# EAGLE design ziegler_sct (EAGLE 9.0.1)
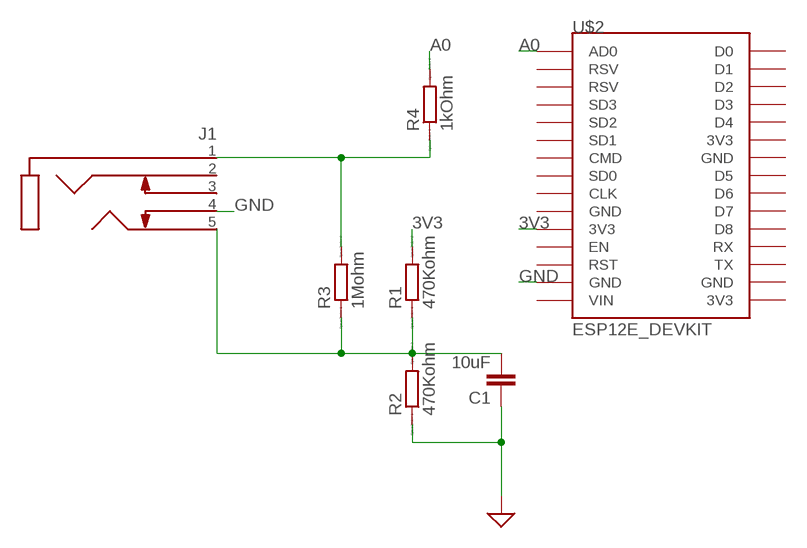
[diagram p0: schematic, sheet 1]

## Parts
C1  10uF  C5/3  [C5B3]
J1  STEREO_JACK3F07  [3.5AUDIO_3F07]
R1  470Kohm  R0204/7  [0204/7]
R2  470Kohm  R0204/7  [0204/7]
R3  1Mohm  R0204/7  [0204/7]
R4  1kOhm  R0204/7  [0204/7]
U$2  ESP12E_DEVKIT  [ESP12E_DEVKIT]

## Nets
3V3: R1.2 U$2.3V3@0(3V3)
A0: R4.2 U$2.AD0
GND: C1.1 J1.4(RSWITCH) R2.1 U$2.GND@1(GND) ; supply symbol labelled SUP
N$1: C1.2 J1.5(RING) R1.1 R2.2 R3.1
N$2: J1.1(SLEEVE) R3.2 R4.1
Unconnected: J1.2(TIP) J1.3(TSWITCH) U$2.3V3@1(3V3) U$2.3V3@2(3V3) U$2.CLK U$2.CMD U$2.D0 U$2.D1 U$2.D2 U$2.D3 U$2.D4 U$2.D5 U$2.D6 U$2.D7 U$2.D8 U$2.EN U$2.GND@0(GND) U$2.GND@2(GND) U$2.GND@3(GND) U$2.RST U$2.RSV@0(RSV) U$2.RSV@1(RSV) U$2.RX U$2.SD0 U$2.SD1 U$2.SD2 U$2.SD3 U$2.TX U$2.VIN

## Library data of the parts
C1 = capacitor-wima:C: CAPACITOR naming: grid - package width
J1 = bt_electromech:STEREO_JACK: 3.5mm Stereo Audio Jack with insert detect switches.
R1-R4 = eagle-ltspice:R: RESISTOR, European symbol; SPICEMODEL: NONE; SPICEPREFIX: R
U$2 = ESP12E_DEVKIT:ESP12E_DEVKIT: ESP12E DEVKIT BOARD

## Net classes
0 default: width 0.305 mm, drill 0.508 mm, clearance 0.254 mm

## Board
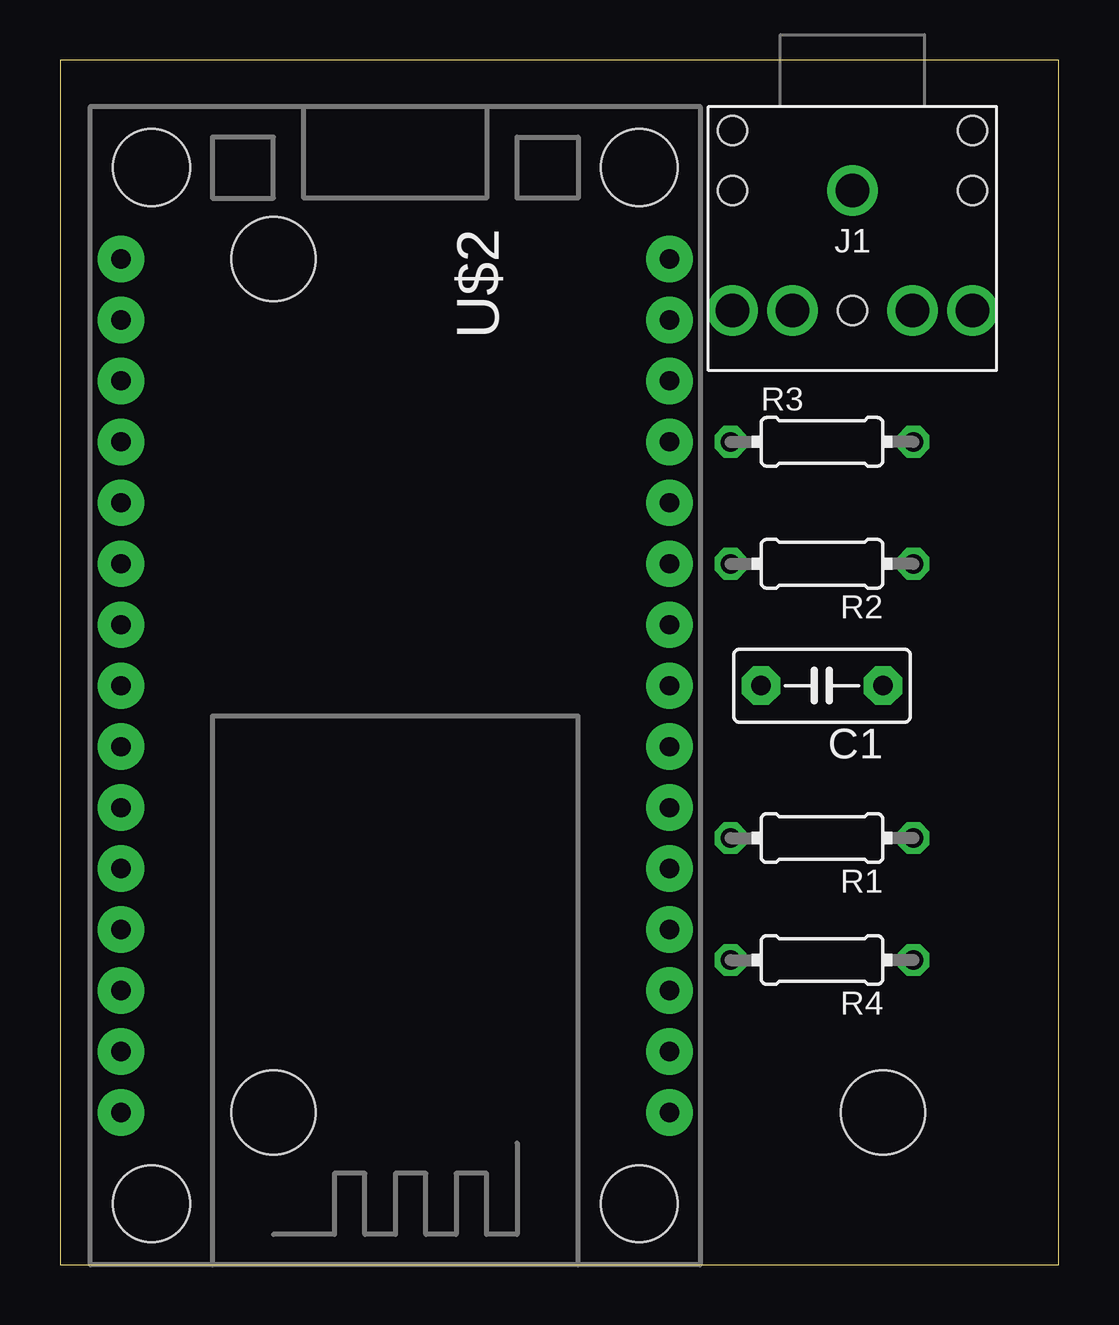
[diagram p1: board, top side]
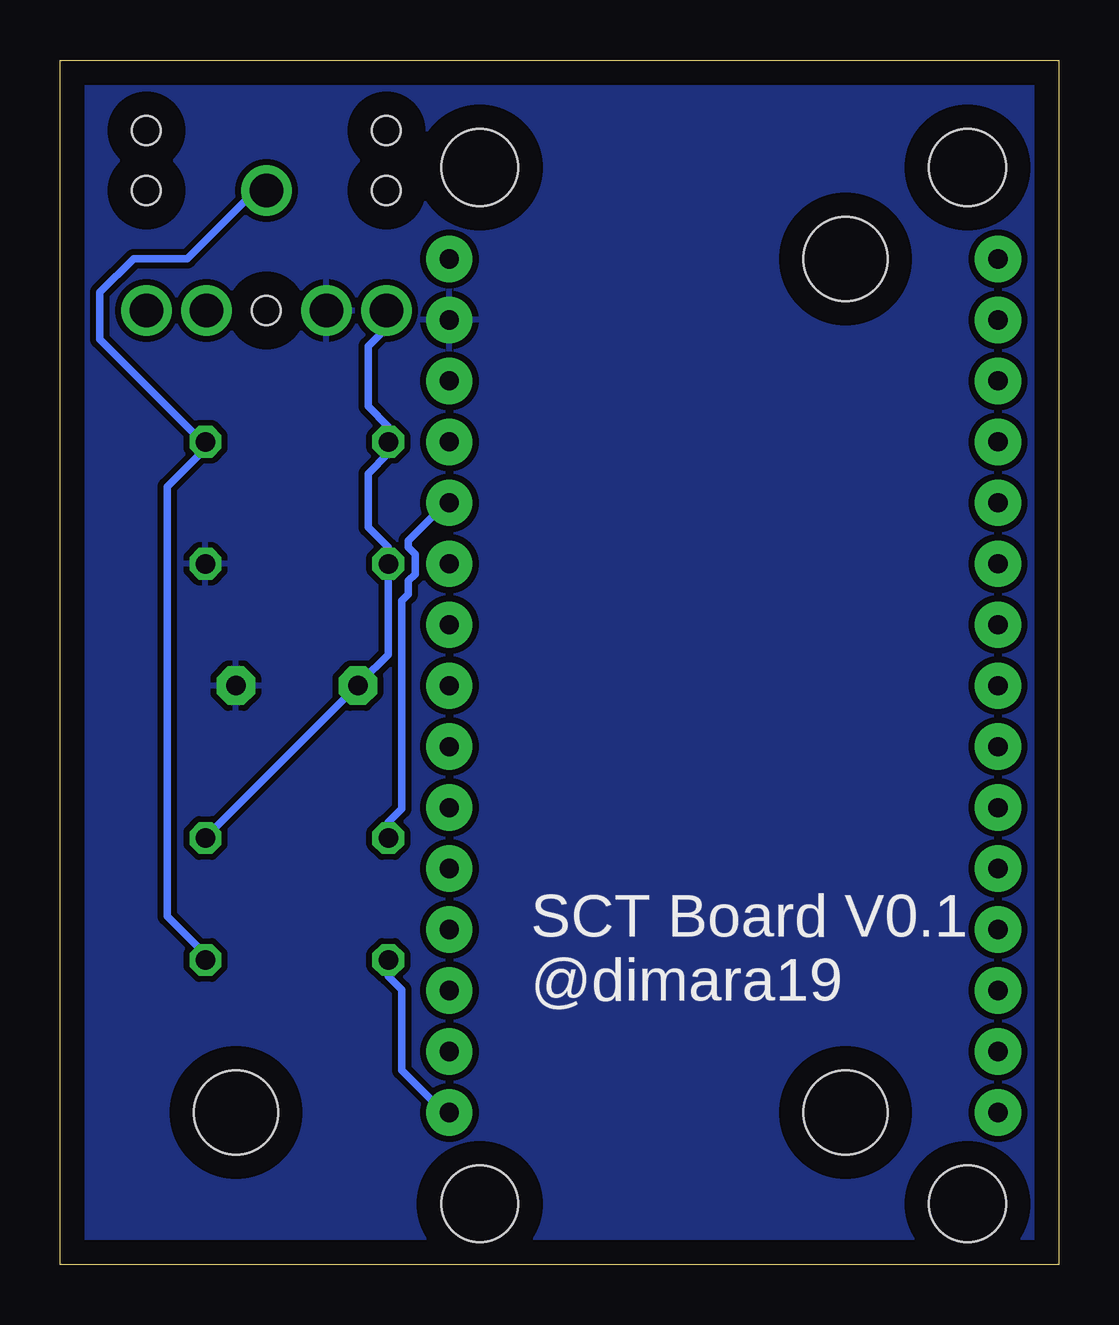
[diagram p2: board, bottom side, seen from below]

Size 41.62 x 50.2 mm. Coordinates in mm from the lower left corner, seen from the top.
Outline: 0,0 41.62,0 41.62,50.2 0,50.2 0,0
Copper layers (1*16): Top 0.035mm / dielectric 1.5mm / Bottom 0.035mm
Design rules "ziegler_sct": minimum track width 6mil, minimum drill 0.35mm, track to track 0.205mm, track to pad 0.205mm, pad to pad 0.205mm, via to via 0.205mm, smd to smd 6mil, copper to edge 40mil, drill to drill 6mil, minimum pad ring 10mil, minimum via ring 8mil, stop-mask expansion 4mil, vias tented up to drill 0mil, thermal gap 10mil
Holes 3.5 mm at 8.89,41.91 8.89,6.35 34.29,6.35

### Footprints (pad centres in the part's own frame; a part is rotated, then mirrored left to right if it is on the bottom)
C5B3 = drill 0.813 pad 1.6 octagon: 1 -2.54,0; 2 2.54,0
3.5AUDIO_3F07 = drill 1.4: 1 0,3.5; 2 -5,8.5; 3 -2.5,8.5; 4 2.5,8.5; 5 5,8.5 | hole 1.2: -5,3.5; -5,1; 5,1; 5,3.5; 0,8.5
0204/7 = drill 0.813 octagon: 1 -3.81,0; 2 3.81,0
ESP12E_DEVKIT = drill 0.8 pad 1.93: 3V3@0 -11.43,-7.62; 3V3@1 11.43,5.08; 3V3@2 11.43,-17.78; AD0 -11.43,17.78; CLK -11.43,-2.54; CMD -11.43,2.54; D0 11.43,17.78; D1 11.43,15.24; D2 11.43,12.7; D3 11.43,10.16; D4 11.43,7.62; D5 11.43,0; D6 11.43,-2.54; D7 11.43,-5.08; D8 11.43,-7.62; EN -11.43,-10.16; GND@0 -11.43,-5.08; GND@1 -11.43,-15.24; GND@2 11.43,2.54; GND@3 11.43,-15.24; RST -11.43,-12.7; RSV@0 -11.43,15.24; RSV@1 -11.43,12.7; RX 11.43,-10.16; SD0 -11.43,0; SD1 -11.43,5.08; SD2 -11.43,7.62; SD3 -11.43,10.16; TX 11.43,-12.7; VIN -11.43,-17.78 | hole 3.2: -10.16,21.59; 10.16,21.59; 10.16,-21.59; -10.16,-21.59

### Placement (x,y rotation side)
C1  31.75,24.13 180 top
J1  33.02,48.26 180 top
R1  31.75,17.78 180 top
R2  31.75,29.21 180 top
R3  31.75,34.29 0 top
R4  31.75,12.7 180 top
U$2  13.97,24.13 180 top

### Tracks (layer width: path | path; a pad name or v marks a point on that pad's centre or on a via)
3V3
  Bottom 0.305: R1.2 27.94,18.44 27.38,19 27.38,27.66 27.1,27.94 27.1,28.5 26.82,28.78 26.82,29.62 27.1,29.9 27.1,30.18 25.43,31.85 U$2.3V3@0
A0
  Bottom 0.305: R4.2 27.94,12.01 27.38,11.46 27.38,8.1 25.43,6.15 U$2.AD0
GND
  pour Bottom: -0.27,50.53 41.91,50.53 41.91,-0.27 -0.27,-0.27
N$1
  Bottom 0.305: R1.1 35.48,17.88 29.34,24.03 C1.2 29.06,24.31 27.94,25.43 R2.2 27.94,29.9 28.78,30.73 28.78,32.97 27.94,33.81 R3.1 27.94,34.92 28.78,35.76 28.78,38.28 28.22,38.84 28.22,39.67 J1.5
N$2
  Bottom 0.305: R4.1 35.76,12.85 35.76,13.13 37.16,14.53 37.16,32.41 35.48,34.09 R3.2 35.48,34.37 35.76,34.65 36.04,34.65 39.95,38.56 39.95,40.51 38.56,41.91 36.32,41.91 33.53,44.7 33.25,44.7 J1.1

### Text on the board
bNames: SCT Board V0.1 / @dimara19